# Altium project 2015_Rx24Duplicator.PrjPcb
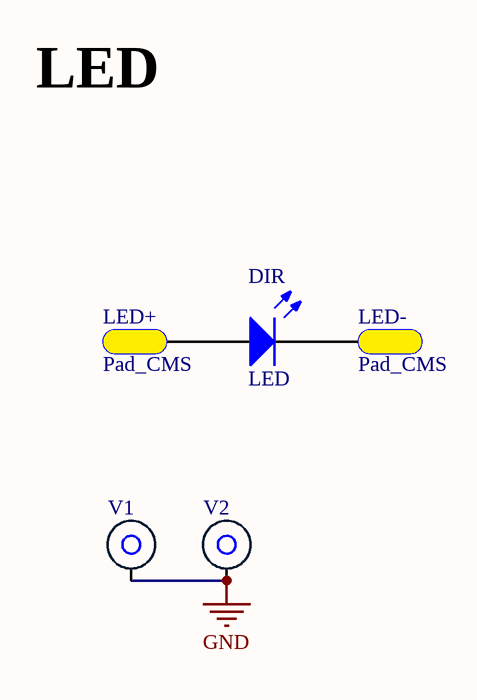
[diagram p0: 2015_Rx24Duplicator.SchDoc]
1 sheet, 5 parts. Net scope: global (net labels, ports and power ports of the same name join across sheets).
Board file: 2015_Rx24Duplicator.PcbDoc

## Sheet 2015_Rx24Duplicator.SchDoc
size A4

### Parts
DIR  LED  [Led_5mm]
LED+  Pad_CMS  [PAD_CMS_5.08x2.54]
LED-  Pad_CMS  [PAD_CMS_5.08x2.54]
V1  Entretoise WURTH CMS  [ENTRETOISE_CMS]  (value not drawn)
V2  Entretoise WURTH CMS  [ENTRETOISE_CMS]  (value not drawn)

### Nets
GND: V1.1 V2.1
NetDIR_1: DIR.1 LED+.1
NetDIR_2: DIR.2 LED-.1

### Notes on the sheet
- LED
- Title
- Size:
- Date:
- A4
- Number:
- Time:
- Revision:
- Sheet
- of
- File:

### Library data of the parts
DIR = LED: Typical RED, GREEN, YELLOW, AMBER GaAs LED; Published: 8-Jun-2000; LatestRevisionDate: 17-Jul-2002; LatestRevisionNote: Re-released for DXP Platform.; PackageDocument: Feb-2002; PackageReference: 3.2X1.6X1.1; Publisher: Altium Limited
LED+ LED- = Pad_CMS: Pad pour souder un fil; LatestRevisionNote: Mech Layer 1 removed.; PackageReference: PAD_CMS; Publisher: Damien Guitton
V1 V2 = Entretoise WURTH CMS: Entretoise Wurth; Publisher: Damien Guitton